# EAGLE design drives (EAGLE 6.6.0)
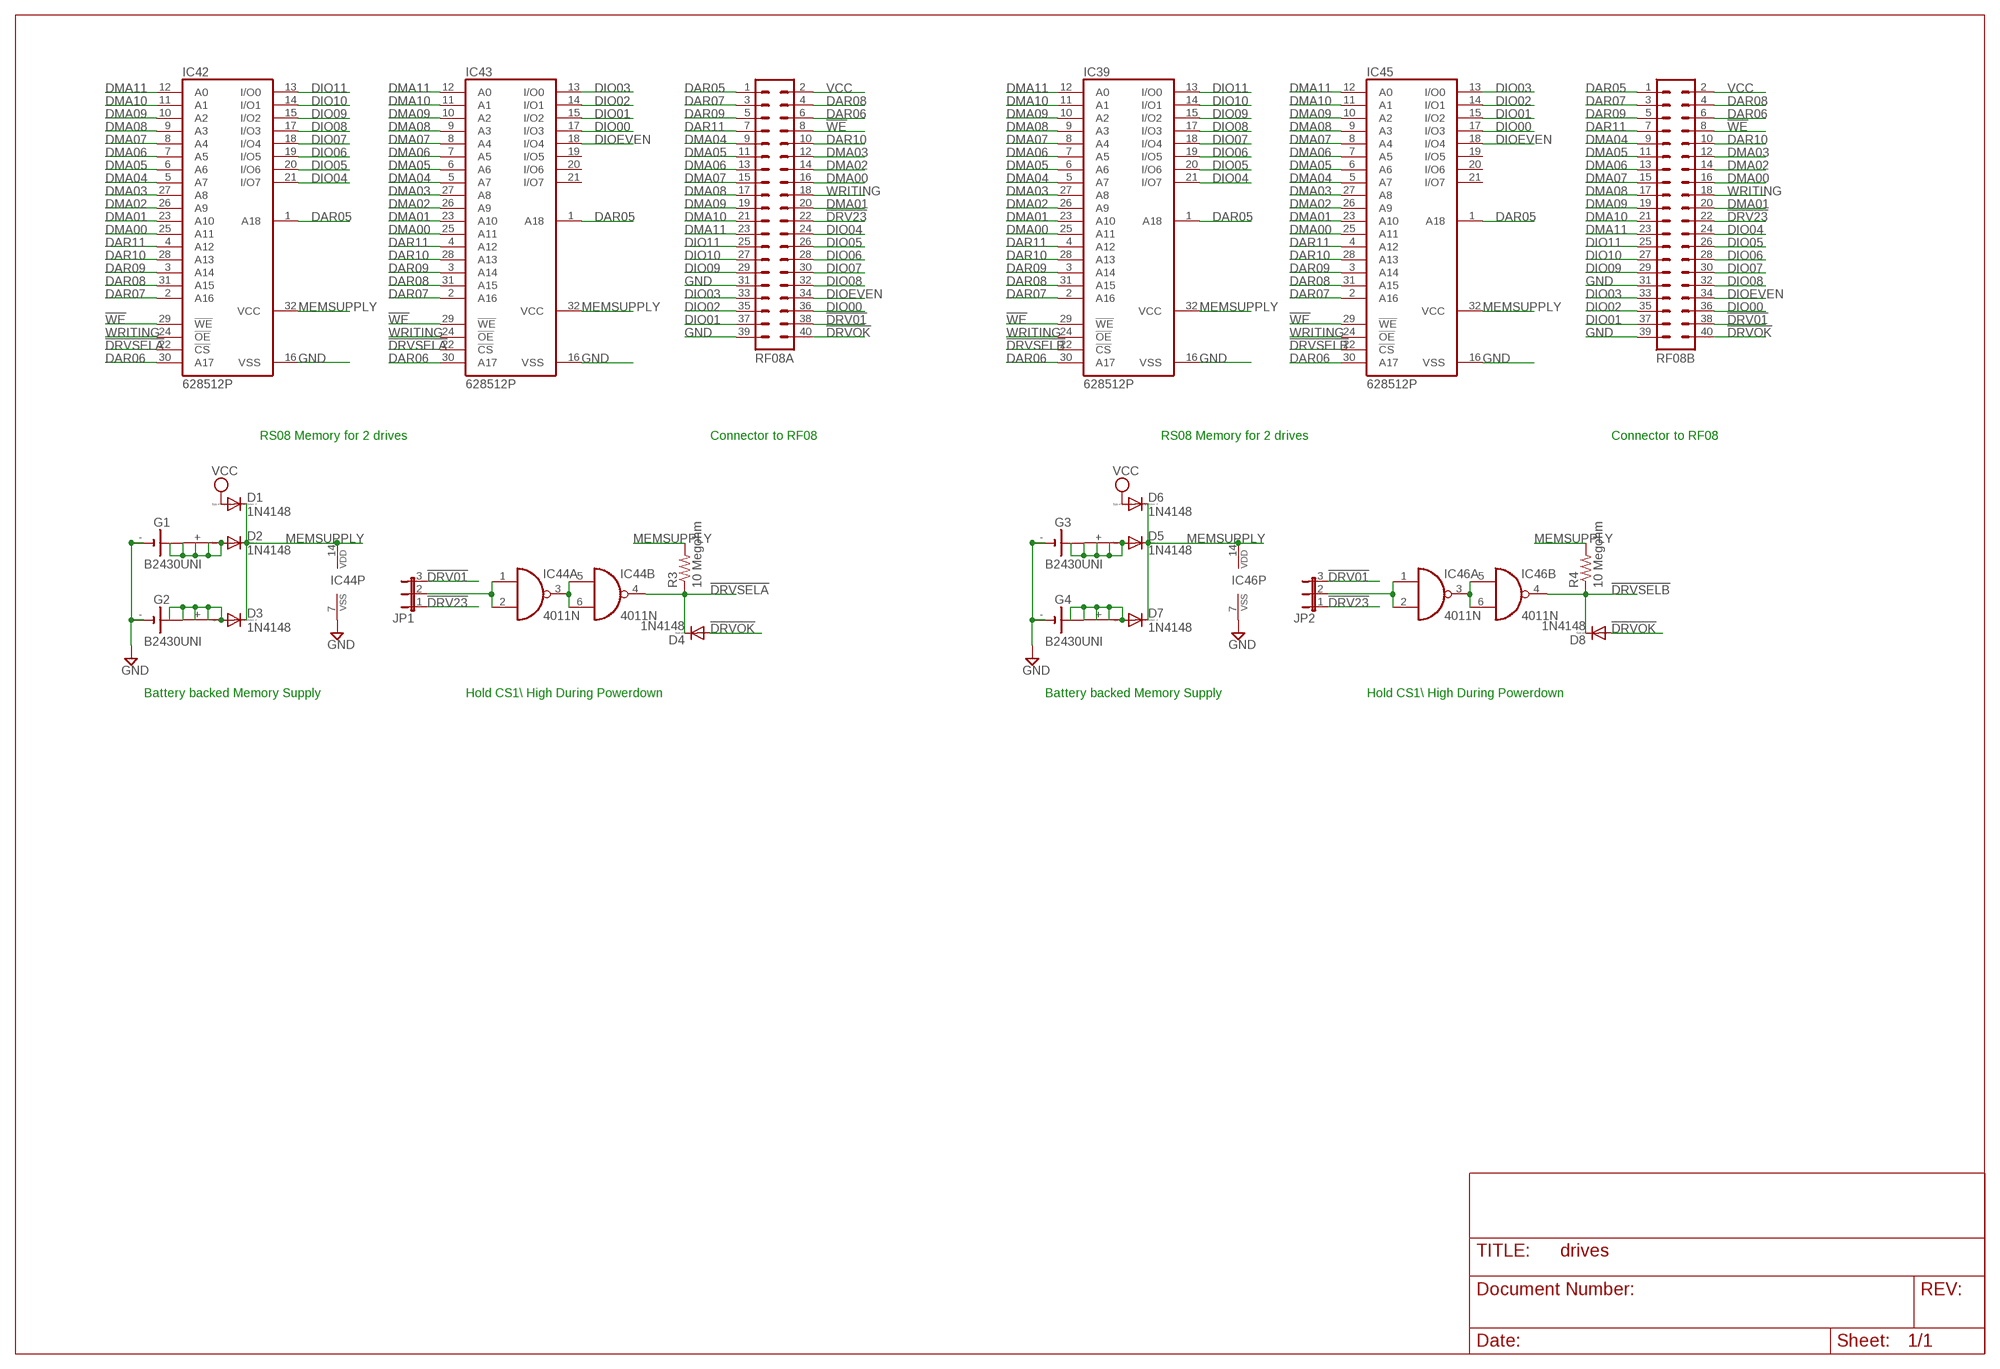
[diagram p0: schematic, sheet 1]

## Parts
D1  1N4148  1N4148DO35-10  [DO35-10]
D2  1N4148  1N4148DO35-10  [DO35-10]
D3  1N4148  1N4148DO35-10  [DO35-10]
D4  1N4148  1N4148DO35-10  [DO35-10]
D5  1N4148  1N4148DO35-10  [DO35-10]
D6  1N4148  1N4148DO35-10  [DO35-10]
D7  1N4148  1N4148DO35-10  [DO35-10]
D8  1N4148  1N4148DO35-10  [DO35-10]
G1  B2430UNI  [B2430UNI]
G2  B2430UNI  [B2430UNI]
G3  B2430UNI  [B2430UNI]
G4  B2430UNI  [B2430UNI]
IC39  628512P  [DIL32]
IC42  628512P  [DIL32]
IC43  628512P  [DIL32]
IC44  4011N  [DIL14]
IC45  628512P  [DIL32]
IC46  4011N  [DIL14]
JP1  JP2E  [JP2]
JP2  JP2E  [JP2]
R3  10 Megohm  R-US_0207/10  [0207/10]
R4  10 Megohm  R-US_0207/10  [0207/10]
RF08A  MA20-2  [MA20-2]
RF08B  MA20-2  [MA20-2]

## Nets
!DRV01: JP1.3 JP2.3 RF08A.38 RF08B.38
!DRV23: JP1.1 JP2.1 RF08A.22 RF08B.22
!DRVOK: D4.A D8.A RF08A.40 RF08B.40
!DRVSELA: D4.C IC42.22(!CS) IC43.22(!CS) IC44.4(B:O) R3.1
!DRVSELB: D8.C IC39.22(!CS) IC45.22(!CS) IC46.4(B:O) R4.1
!WE: IC39.29(!WE) IC42.29(!WE) IC43.29(!WE) IC45.29(!WE) RF08A.8 RF08B.8
DAR05: IC39.1(A18) IC42.1(A18) IC43.1(A18) IC45.1(A18) RF08A.1 RF08B.1
DAR06: IC39.30(A17) IC42.30(A17) IC43.30(A17) IC45.30(A17) RF08A.6 RF08B.6
DAR07: IC39.2(A16) IC42.2(A16) IC43.2(A16) IC45.2(A16) RF08A.3 RF08B.3
DAR08: IC39.31(A15) IC42.31(A15) IC43.31(A15) IC45.31(A15) RF08A.4 RF08B.4
DAR09: IC39.3(A14) IC42.3(A14) IC43.3(A14) IC45.3(A14) RF08A.5 RF08B.5
DAR10: IC39.28(A13) IC42.28(A13) IC43.28(A13) IC45.28(A13) RF08A.10 RF08B.10
DAR11: IC39.4(A12) IC42.4(A12) IC43.4(A12) IC45.4(A12) RF08A.7 RF08B.7
DIO00: IC43.17(I/O3) IC45.17(I/O3) RF08A.36 RF08B.36
DIO01: IC43.15(I/O2) IC45.15(I/O2) RF08A.37 RF08B.37
DIO02: IC43.14(I/O1) IC45.14(I/O1) RF08A.35 RF08B.35
DIO03: IC43.13(I/O0) IC45.13(I/O0) RF08A.33 RF08B.33
DIO04: IC39.21(I/O7) IC42.21(I/O7) RF08A.24 RF08B.24
DIO05: IC39.20(I/O6) IC42.20(I/O6) RF08A.26 RF08B.26
DIO06: IC39.19(I/O5) IC42.19(I/O5) RF08A.28 RF08B.28
DIO07: IC39.18(I/O4) IC42.18(I/O4) RF08A.30 RF08B.30
DIO08: IC39.17(I/O3) IC42.17(I/O3) RF08A.32 RF08B.32
DIO09: IC39.15(I/O2) IC42.15(I/O2) RF08A.29 RF08B.29
DIO10: IC39.14(I/O1) IC42.14(I/O1) RF08A.27 RF08B.27
DIO11: IC39.13(I/O0) IC42.13(I/O0) RF08A.25 RF08B.25
DIOEVEN: IC43.18(I/O4) IC45.18(I/O4) RF08A.34 RF08B.34
DMA00: IC39.25(A11) IC42.25(A11) IC43.25(A11) IC45.25(A11) RF08A.16 RF08B.16
DMA01: IC39.23(A10) IC42.23(A10) IC43.23(A10) IC45.23(A10) RF08A.20 RF08B.20
DMA02: IC39.26(A9) IC42.26(A9) IC43.26(A9) IC45.26(A9) RF08A.14 RF08B.14
DMA03: IC39.27(A8) IC42.27(A8) IC43.27(A8) IC45.27(A8) RF08A.12 RF08B.12
DMA04: IC39.5(A7) IC42.5(A7) IC43.5(A7) IC45.5(A7) RF08A.9 RF08B.9
DMA05: IC39.6(A6) IC42.6(A6) IC43.6(A6) IC45.6(A6) RF08A.11 RF08B.11
DMA06: IC39.7(A5) IC42.7(A5) IC43.7(A5) IC45.7(A5) RF08A.13 RF08B.13
DMA07: IC39.8(A4) IC42.8(A4) IC43.8(A4) IC45.8(A4) RF08A.15 RF08B.15
DMA08: IC39.9(A3) IC42.9(A3) IC43.9(A3) IC45.9(A3) RF08A.17 RF08B.17
DMA09: IC39.10(A2) IC42.10(A2) IC43.10(A2) IC45.10(A2) RF08A.19 RF08B.19
DMA10: IC39.11(A1) IC42.11(A1) IC43.11(A1) IC45.11(A1) RF08A.21 RF08B.21
DMA11: IC39.12(A0) IC42.12(A0) IC43.12(A0) IC45.12(A0) RF08A.23 RF08B.23
GND: G1.- G1.-@1(-) G2.- G2.-@1(-) G3.- G3.-@1(-) G4.- G4.-@1(-) IC39.16(VSS) IC42.16(VSS) IC43.16(VSS) IC44.7(P:VSS) IC45.16(VSS) IC46.7(P:VSS) RF08A.31 RF08A.39 RF08B.31 RF08B.39
MEMSUPPLY [Power]: D1.C D2.C D3.C D5.C D6.C D7.C IC39.32(VCC) IC42.32(VCC) IC43.32(VCC) IC44.14(P:VDD) IC45.32(VCC) IC46.14(P:VDD) R3.2 R4.2
N$18: IC44.3(A:O) IC44.5(B:I0) IC44.6(B:I1)
N$35: IC44.1(A:I0) IC44.2(A:I1) JP1.2
N$36: D7.A G4.+ G4.+@1(+) G4.+@2(+) G4.+@3(+) G4.+@4(+)
N$38: IC46.3(A:O) IC46.5(B:I0) IC46.6(B:I1)
N$39: IC46.1(A:I0) IC46.2(A:I1) JP2.2
N$41: D5.A G3.+ G3.+@1(+) G3.+@2(+) G3.+@3(+) G3.+@4(+)
N$130: D3.A G2.+ G2.+@1(+) G2.+@2(+) G2.+@3(+) G2.+@4(+)
N$131: D2.A G1.+ G1.+@1(+) G1.+@2(+) G1.+@3(+) G1.+@4(+)
VCC [Power]: D1.A D6.A RF08A.2 RF08B.2
WRITING: IC39.24(!OE) IC42.24(!OE) IC43.24(!OE) IC45.24(!OE) RF08A.18 RF08B.18
Unconnected: IC43.19(I/O5) IC43.20(I/O6) IC43.21(I/O7) IC44.8(C:I0) IC44.9(C:I1) IC44.10(C:O) IC44.11(D:O) IC44.12(D:I0) IC44.13(D:I1) IC45.19(I/O5) IC45.20(I/O6) IC45.21(I/O7) IC46.8(C:I0) IC46.9(C:I1) IC46.10(C:O) IC46.11(D:O) IC46.12(D:I0) IC46.13(D:I1)

## Notes on the sheet
- RS08 Memory for 2 drives | Connector to RF08 | RS08 Memory for 2 drives | Connector to RF08
- Battery backed Memory Supply | Hold CS1\\ High During Powerdown | Battery backed Memory Supply | Hold CS1\\ High During Powerdown

## Library data of the parts
D1-D8 = diode:1N4148: DIODE high speed (Philips)
G1-G4 = battery:B2430UNI: LI BATTERY
IC39 IC42 IC43 IC45 = dec-con:628512P: 512Kx8 Static RAM
IC44 IC46 = 40xx:4011: Quad 2-input NAND
JP1 JP2 = jumper:JP2E: JUMPER
R3 R4 = rcl:R-US_: RESISTOR, American symbol
RF08A RF08B = con-lstb:MA20-2: PIN HEADER; OC_FARNELL: unknown; OC_NEWARK: unknown

## Net classes
1 Power: width 0.508 mm

## Board
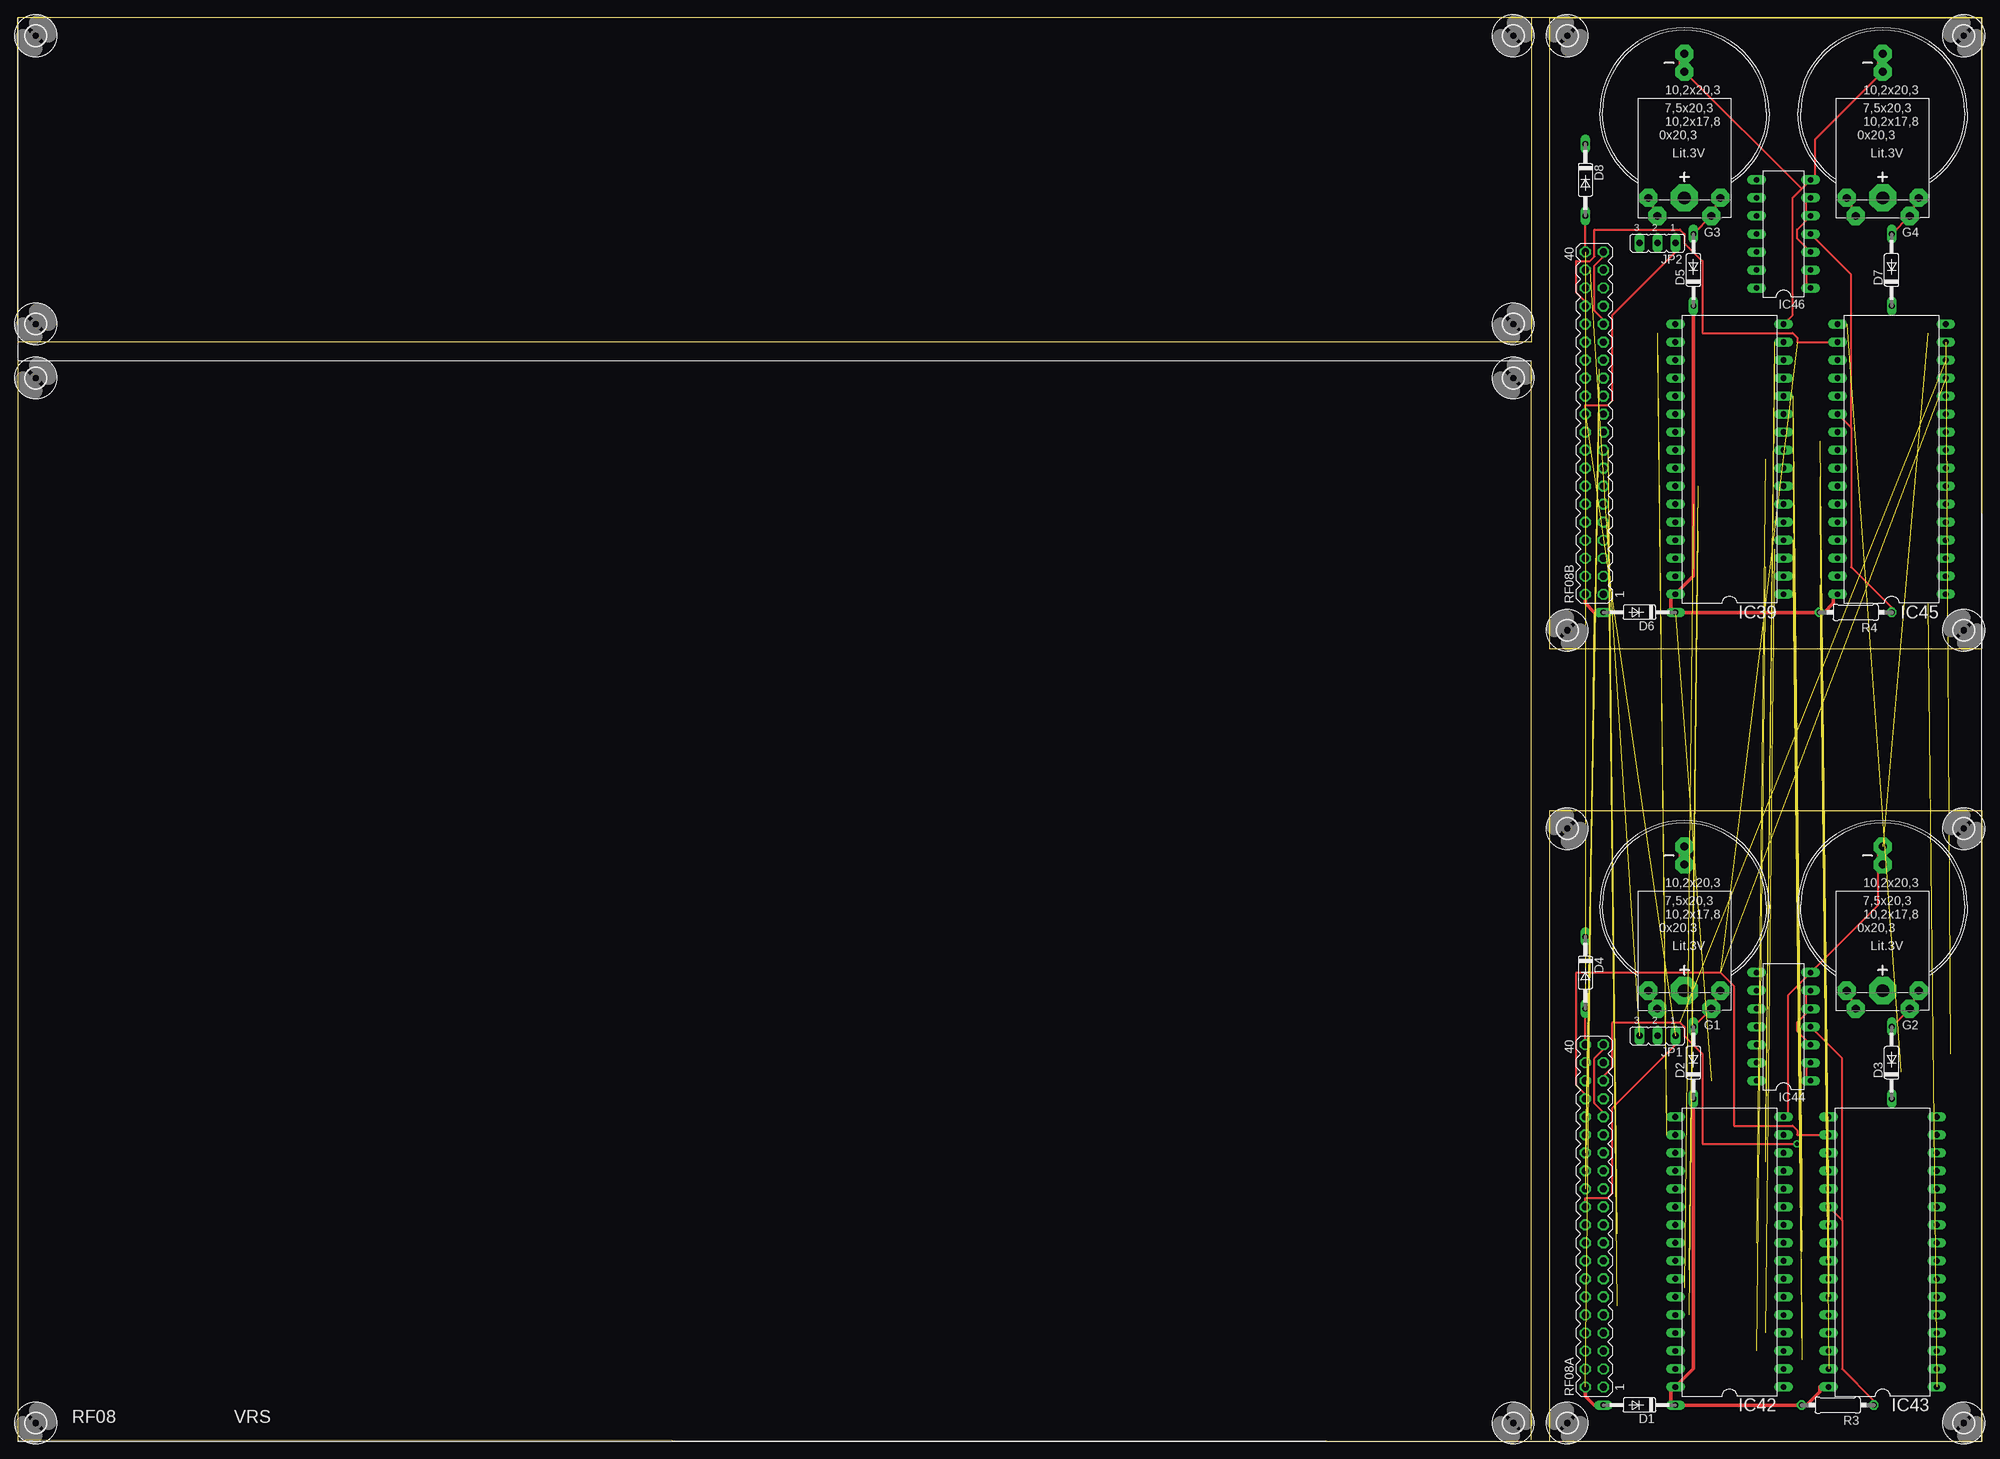
[diagram p1: board, top side]
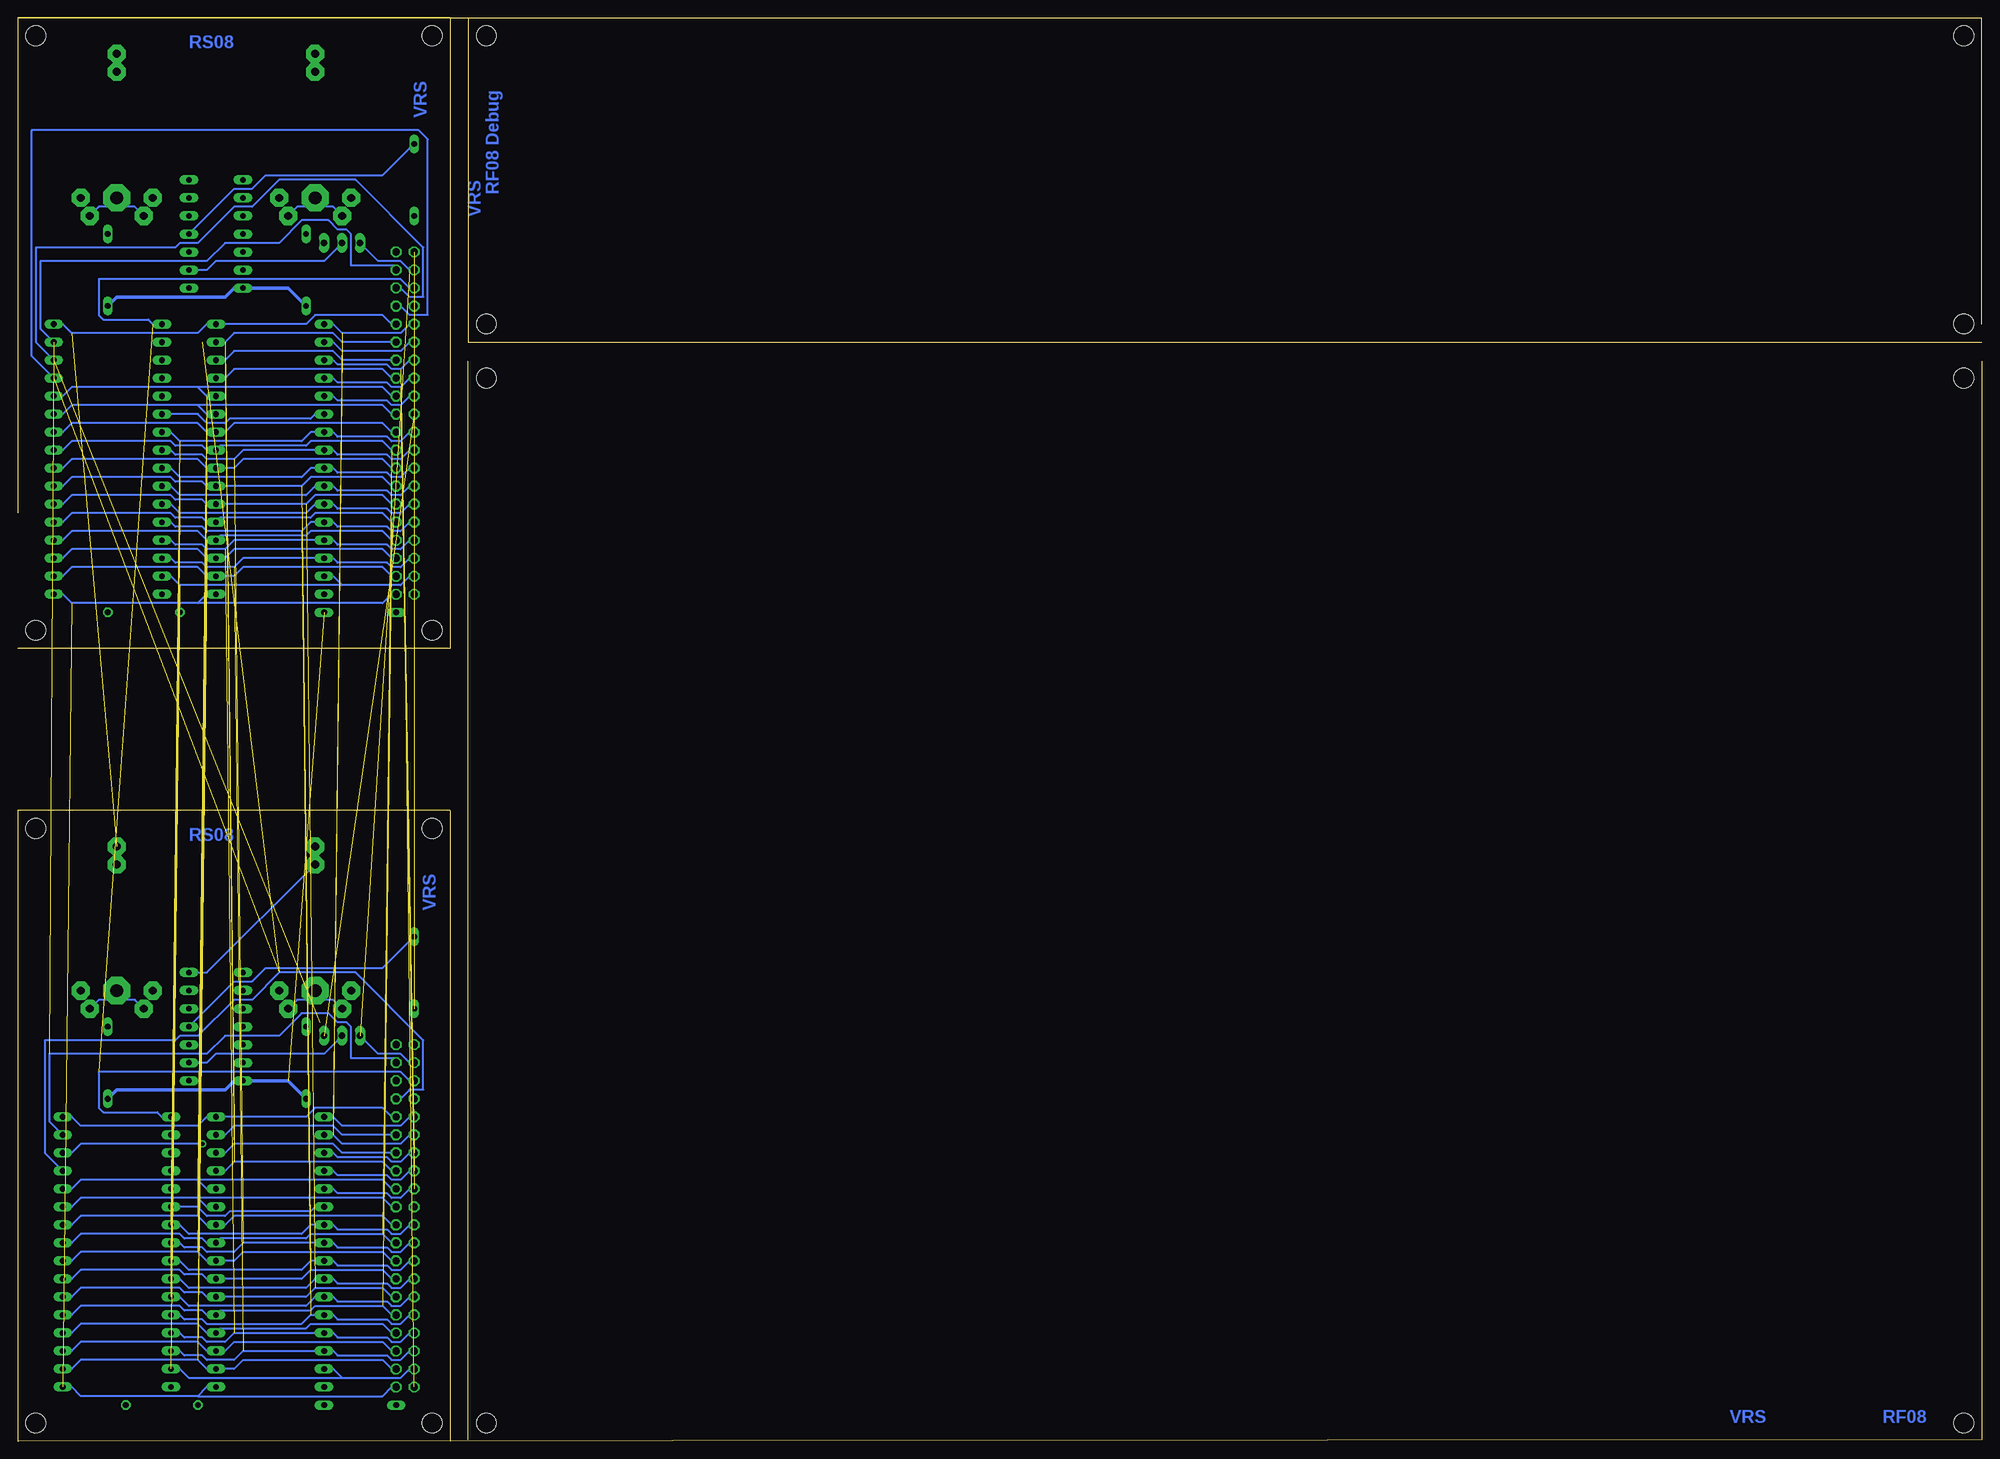
[diagram p2: board, bottom side, seen from below]

Size 276.86 x 200.67 mm. Coordinates in mm from the lower left corner, seen from the top.
Outline: 276.69,0 0.01,0.18 0.01,152.25
Outline: 213.34,0.18 213.34,152.25
Outline: 215.9,0.01 215.9,88.92 276.86,88.92 276.86,0.01
Outline: 276.86,111.78 215.9,111.78 215.9,200.67 276.86,200.67
Outline: 276.86,200.67 0,200.67 0,157.49
Outline: 276.86,200.67 276.86,130.82
Outline: 0,154.95 213.36,154.95 213.36,200.67
Copper layers (1*16): Top 0.035mm / dielectric 1.5mm / Bottom 0.035mm
Design rules "olimex10mil": minimum track width 10mil, minimum drill 24mil, track to track 10mil, track to pad 10mil, pad to pad 10mil, via to via 10mil, smd to smd 10mil, copper to edge 40mil, drill to drill 10mil, minimum pad ring 10mil, minimum via ring 8mil, stop-mask expansion 0mil, vias tented up to drill 0mil, thermal gap 10mil

### Footprints (pad centres in the part's own frame; a part is rotated, then mirrored left to right if it is on the bottom)
DO35-10 = drill 0.813 long: A 5.08,0; C -5.08,0
B2430UNI = drill 1.118 pad 2.54 octagon: + 3.81,14.605; +@1 -3.81,14.605; +@2 -5.08,12.065; +@3 5.08,12.065; - 0,-5.715; -@1 0,-8.255 | drill 1.803 pad 3.81 octagon: +@4 0,12.065
DIL32 = drill 0.813 long: 1 -19.05,-7.62; 2 -16.51,-7.62; 3 -13.97,-7.62; 4 -11.43,-7.62; 5 -8.89,-7.62; 6 -6.35,-7.62; 7 -3.81,-7.62; 8 -1.27,-7.62; 9 1.27,-7.62; 10 3.81,-7.62; 11 6.35,-7.62; 12 8.89,-7.62; 13 11.43,-7.62; 14 13.97,-7.62; 15 16.51,-7.62; 16 19.05,-7.62; 17 19.05,7.62; 18 16.51,7.62; 19 13.97,7.62; 20 11.43,7.62; 21 8.89,7.62; 22 6.35,7.62; 23 3.81,7.62; 24 1.27,7.62; 25 -1.27,7.62; 26 -3.81,7.62; 27 -6.35,7.62; 28 -8.89,7.62; 29 -11.43,7.62; 30 -13.97,7.62; 31 -16.51,7.62; 32 -19.05,7.62
DIL14 = drill 0.813 long: 1 -7.62,-3.81; 2 -5.08,-3.81; 3 -2.54,-3.81; 4 0,-3.81; 5 2.54,-3.81; 6 5.08,-3.81; 7 7.62,-3.81; 8 7.62,3.81; 9 5.08,3.81; 10 2.54,3.81; 11 0,3.81; 12 -2.54,3.81; 13 -5.08,3.81; 14 -7.62,3.81
JP2 = drill 0.914 long: 1 -2.54,0; 2 0,0; 3 2.54,0
0207/10 = drill 0.813 octagon: 1 -5.08,0; 2 5.08,0
MA20-2 = drill 1.016 octagon: 1 -24.13,-1.27; 2 -24.13,1.27; 3 -21.59,-1.27; 4 -21.59,1.27; 5 -19.05,-1.27; 6 -19.05,1.27; 7 -16.51,-1.27; 8 -16.51,1.27; 9 -13.97,-1.27; 10 -13.97,1.27; 11 -11.43,-1.27; 12 -11.43,1.27; 13 -8.89,-1.27; 14 -8.89,1.27; 15 -6.35,-1.27; 16 -6.35,1.27; 17 -3.81,-1.27; 18 -3.81,1.27; 19 -1.27,-1.27; 20 -1.27,1.27; 21 1.27,-1.27; 22 1.27,1.27; 23 3.81,-1.27; 24 3.81,1.27; 25 6.35,-1.27; 26 6.35,1.27; 27 8.89,-1.27; 28 8.89,1.27; 29 11.43,-1.27; 30 11.43,1.27; 31 13.97,-1.27; 32 13.97,1.27; 33 16.51,-1.27; 34 16.51,1.27; 35 19.05,-1.27; 36 19.05,1.27; 37 21.59,-1.27; 38 21.59,1.27; 39 24.13,-1.27; 40 24.13,1.27
2,8 = hole 2.8: 0,0

### Placement (x,y rotation side)
D1  228.6,5.09 180 top
D2  236.22,53.36 90 top
D3  264.16,53.36 90 top
D4  220.98,66.06 270 top
D5  236.22,165.11 90 top
D6  228.6,116.86 180 top
D7  264.16,165.11 90 top
D8  220.98,177.81 270 top
G1  234.95,75.58 180 top
G2  262.89,75.58 180 top
G3  234.95,187.34 180 top
G4  262.89,187.34 180 top
IC39  241.3,138.44 90 top
IC42  241.3,26.69 90 top
IC43  262.89,26.69 90 top
IC44  248.92,58.44 90 top
IC45  264.16,138.44 90 top
IC46  248.92,170.19 90 top
JP1  231.14,57.16 180 top
JP2  231.14,168.92 180 top
R3  256.54,5.09 180 top
R4  259.08,116.86 180 top
RF08A  222.25,31.77 90 top
RF08B  222.25,143.52 90 top
U$1  [2,8]  2.54,149.88 0 top
U$2  [2,8]  210.82,149.88 0 top
U$3  [2,8]  2.54,2.56 0 top
U$4  [2,8]  210.82,2.56 0 top
U$5  [2,8]  274.32,2.56 90 top
U$6  [2,8]  218.44,2.56 90 top
U$7  [2,8]  218.44,86.38 90 top
U$8  [2,8]  274.32,86.38 90 top
U$9  [2,8]  274.32,198.13 90 top
U$10  [2,8]  274.32,114.31 90 top
U$11  [2,8]  218.44,114.31 90 top
U$12  [2,8]  218.44,198.13 90 top
U$13  [2,8]  2.54,157.49 0 top
U$14  [2,8]  2.54,198.13 0 top
U$16  [2,8]  210.82,157.49 0 top
U$17  [2,8]  210.82,198.13 0 top
U$18  [SIERRA-PROTO]  0,0.01 0 top

### Tracks (layer width: path | path; a pad name or v marks a point on that pad's centre or on a via)
!DRV01  (1 unrouted)
  Bottom 0.254: JP1.3 226.06,54.62 222.88,54.62 221.62,53.36 RF08A.38 | JP2.3 226.06,166.38 222.88,166.38 221.62,165.11 RF08B.38
!DRV23  (1 unrouted)
  Top 0.254: JP1.1 233.68,55.9 224.79,47.01 224.79,34.94 224.16,34.3 220.98,34.3 RF08A.22 | JP2.1 233.68,167.65 224.79,158.76 224.79,146.7 224.16,146.06 220.98,146.06 RF08B.22
!DRVOK  (1 unrouted)
  Top 0.254: RF08A.40 D4.A | RF08B.40 D8.A
!DRVSELA
  Top 0.254: 257.18,31.13 257.18,10.18 261.62,5.73 R3.1 | IC43.22 257.18,31.13 | 257.18,31.13 257.18,53.99 IC44.4
  Bottom 0.254: IC42.22 234.95,33.04 235.59,32.4 247.01,32.4 247.65,31.77 250.19,31.77 251.46,33.04 IC43.22 | D4.C 225.43,66.69 241.94,66.69 243.84,64.78 246.38,64.78 IC44.4
!DRVSELB
  Top 0.254: 258.44,142.89 258.44,123.2 264.16,117.49 R4.1 | IC45.22 258.44,142.89 | 258.44,142.89 258.44,164.48 IC46.4
  Bottom 0.254: IC39.22 234.95,144.79 235.59,144.16 247.01,144.16 247.65,143.52 250.19,143.52 251.46,144.79 IC45.22 | D8.C 225.43,178.45 241.94,178.45 243.84,176.54 246.38,176.54 IC46.4
!WE  (1 unrouted)
  Bottom 0.254: RF08A.8 221.62,15.26 222.88,13.99 224.16,13.99 224.79,14.62 231.78,14.62 232.41,15.26 IC42.29 246.38,15.26 247.65,13.99 250.19,13.99 250.82,14.62 253.37,14.62 254,15.26 IC43.29 | RF08B.8 221.62,127.02 222.88,125.75 224.16,125.75 224.79,126.38 231.78,126.38 232.41,127.02 IC39.29 246.38,127.02 247.65,125.75 250.19,125.75 250.82,126.38 254.63,126.38 255.27,127.02 IC45.29
DAR05  (1 unrouted)
  Bottom 0.254: 251.46,118.12 250.19,119.39 IC39.1 | 251.46,118.12 269.24,118.12 270.51,119.39 IC45.1 | 251.46,118.12 225.43,118.12 224.16,119.39 RF08B.1 | 251.46,6.36 250.19,7.63 IC42.1 | 251.46,6.36 267.97,6.36 269.24,7.63 IC43.1 | 251.46,6.36 225.43,6.36 224.16,7.63 RF08A.1
DAR06  (1 unrouted)
  Bottom 0.254: RF08A.6 221.62,12.71 222.88,11.45 224.16,11.45 224.79,12.08 231.78,12.08 232.41,12.71 IC42.30 245.11,12.71 246.38,11.45 250.19,11.45 250.82,12.08 253.37,12.08 254,12.71 IC43.30 | RF08B.6 221.62,124.47 222.88,123.2 224.16,123.2 224.79,123.84 231.78,123.84 232.41,124.47 IC39.30 245.11,124.47 246.38,123.2 250.19,123.2 250.82,123.84 254.63,123.84 255.27,124.47 IC45.30
DAR07  (1 unrouted)
  Bottom 0.254: IC43.2 269.24,10.18 267.97,11.45 251.46,11.45 250.19,10.18 IC42.2 246.38,10.18 245.11,11.45 225.43,11.45 224.16,10.18 RF08A.3 | IC45.2 270.51,121.94 269.24,123.2 251.46,123.2 250.19,121.94 IC39.2 246.38,121.94 245.11,123.2 225.43,123.2 224.16,121.94 RF08B.3
DAR08  (1 unrouted)
  Bottom 0.254: 231.14,8.91 232.41,10.18 IC42.31 | 231.14,8.91 222.88,8.91 221.62,10.18 RF08A.4 | 231.14,8.91 252.73,8.91 254,10.18 IC43.31 | 231.14,120.67 232.41,121.94 IC39.31 | 231.14,120.67 222.88,120.67 221.62,121.94 RF08B.4 | 231.14,120.67 254,120.67 255.27,121.94 IC45.31
DAR09  (1 unrouted)
  Bottom 0.254: IC45.3 270.51,124.47 269.24,125.75 251.46,125.75 250.19,124.47 IC39.3 247.65,124.47 246.38,125.75 225.43,125.75 224.16,124.47 RF08B.5 | IC43.3 269.24,12.71 267.97,13.99 251.46,13.99 250.19,12.71 IC42.3 247.65,12.71 246.38,13.99 225.43,13.99 224.16,12.71 RF08A.5
DAR10  (1 unrouted)
  Bottom 0.254: RF08A.10 221.62,17.8 222.88,16.53 224.16,16.53 224.79,17.16 231.78,17.16 232.41,17.8 IC42.28 235.59,17.8 236.85,16.53 250.19,16.53 250.82,17.16 253.37,17.16 254,17.8 IC43.28 | RF08B.10 221.62,129.55 222.88,128.28 224.16,128.28 224.79,128.92 231.78,128.92 232.41,129.55 IC39.28 235.59,129.55 236.85,128.28 250.19,128.28 250.82,128.92 254.63,128.92 255.27,129.55 IC45.28
DAR11  (1 unrouted)
  Bottom 0.254: IC45.4 270.51,127.02 269.24,128.28 251.46,128.28 250.19,127.02 IC39.4 248.28,127.65 236.22,127.65 235.59,128.28 225.43,128.28 224.16,127.02 RF08B.7 | IC43.4 269.24,15.26 267.97,16.53 251.46,16.53 250.19,15.26 IC42.4 248.28,15.89 236.22,15.89 235.59,16.53 225.43,16.53 224.16,15.26 RF08A.7
DIO00  (1 unrouted)
  Bottom 0.254: IC43.17 256.54,45.73 257.18,46.37 264.8,46.37 265.43,47.01 265.43,52.09 222.88,52.09 221.62,50.81 RF08A.36 | IC45.17 257.81,157.49 258.44,158.13 264.8,158.13 265.43,158.76 265.43,163.84 222.88,163.84 221.62,162.57 RF08B.36
DIO01  (1 unrouted)
  Bottom 0.254: IC43.15 272.42,45.1 272.42,54.62 250.19,54.62 247.65,57.16 240.03,57.16 236.85,60.34 233.04,60.34 231.78,59.07 230.5,59.07 229.87,58.44 229.87,53.99 223.52,53.99 RF08A.37 | IC45.15 273.69,156.86 273.69,166.38 250.19,166.38 247.65,168.92 240.03,168.92 236.85,172.1 233.04,172.1 231.78,170.83 230.5,170.83 229.87,170.19 229.87,165.75 223.52,165.75 RF08B.37
DIO02  (via drill 0.61)  (1 unrouted)
  Top 0.254: v250.82,41.92 237.49,41.92 237.49,54.62 234.95,57.16 234.95,58.44 234.31,59.07 224.79,59.07 224.79,52.72 223.52,51.45 RF08A.35
  Bottom 0.254: v250.82,41.92 267.97,41.92 269.24,40.66 IC43.14 | IC45.14 274.32,154.95 274.32,168.29 254.63,168.29 254,168.92 251.46,168.92 246.38,174 243.84,174 240.03,177.81 229.24,177.81 219.71,168.29 219.71,161.3 221.62,161.3 222.88,162.57 RF08B.35
DIO03  (1 unrouted)
  Bottom 0.254: IC43.13 273.05,40.66 273.05,56.53 254.63,56.53 254,57.16 251.46,57.16 246.38,62.24 243.84,62.24 240.03,66.06 229.24,66.06 219.71,56.53 219.71,49.55 221.62,49.55 222.88,48.27 RF08A.33 | IC45.13 274.95,153.05 274.95,184.8 220.34,184.8 219.07,183.53 219.07,158.76 221.62,158.76 222.88,160.03 RF08B.33
DIO04  (1 unrouted)
  Bottom 0.254: IC42.21 232.41,35.58 231.78,34.94 224.79,34.94 224.16,34.3 222.88,34.3 221.62,35.58 RF08A.24 | IC39.21 232.41,147.33 231.78,146.7 224.79,146.7 224.16,146.06 222.88,146.06 221.62,147.33 RF08B.24
DIO05  (1 unrouted)
  Bottom 0.254: IC42.20 232.41,38.12 231.78,37.48 224.79,37.48 224.16,36.84 222.88,36.84 221.62,38.12 RF08A.26 | IC39.20 232.41,149.88 231.78,149.24 224.79,149.24 224.16,148.6 222.88,148.6 221.62,149.88 RF08B.26
DIO06  (1 unrouted)
  Bottom 0.254: IC42.19 232.41,40.66 231.78,40.02 224.79,40.02 224.16,39.38 222.88,39.38 221.62,40.66 RF08A.28 | IC39.19 232.41,152.41 231.78,151.78 224.79,151.78 224.16,151.14 222.88,151.14 221.62,152.41 RF08B.28
DIO07  (1 unrouted)
  Bottom 0.254: IC42.18 232.41,43.2 231.14,41.92 222.88,41.92 221.62,43.2 RF08A.30 | IC39.18 232.41,154.95 231.14,153.68 222.88,153.68 221.62,154.95 RF08B.30
DIO08  (1 unrouted)
  Bottom 0.254: IC42.17 232.41,45.73 231.14,44.47 222.88,44.47 221.62,45.73 RF08A.32 | IC39.17 232.41,157.49 231.14,156.22 222.88,156.22 221.62,157.49 RF08B.32
DIO09  (1 unrouted)
  Bottom 0.254: IC42.15 247.65,43.2 246.38,44.47 232.41,44.47 231.14,43.2 RF08A.29 | IC39.15 247.65,154.95 246.38,156.22 232.41,156.22 231.14,154.95 RF08B.29
DIO10  (1 unrouted)
  Bottom 0.254: IC42.14 247.65,40.66 246.38,41.92 232.41,41.92 231.14,40.66 RF08A.27 | IC39.14 247.65,152.41 246.38,153.68 232.41,153.68 231.14,152.41 RF08B.27
DIO11  (1 unrouted)
  Bottom 0.254: IC42.13 247.65,38.12 246.38,39.38 225.43,39.38 224.16,38.12 RF08A.25 | IC39.13 247.65,149.88 246.38,151.14 225.43,151.14 224.16,149.88 RF08B.25
DIOEVEN  (1 unrouted)
  Top 0.254: IC43.18 250.82,43.2 250.82,43.83 250.19,44.47 241.94,44.47 241.94,64.15 240.03,66.06 219.71,66.06 219.71,50.18 220.98,48.91 RF08A.34 | IC45.18 250.82,154.95 250.82,155.59 250.19,156.22 237.49,156.22 237.49,166.38 234.95,168.92 234.95,170.19 234.31,170.83 222.25,170.83 222.25,167.02 221.62,166.38 219.71,166.38 219.71,161.94 220.98,160.67 RF08B.34
DMA00  (1 unrouted)
  Bottom 0.254: RF08A.16 221.62,25.41 222.88,24.14 224.16,24.14 224.79,24.78 231.78,24.78 232.41,25.41 IC42.25 235.59,25.41 236.85,24.14 252.73,24.14 254,25.41 IC43.25 | RF08B.16 221.62,137.17 222.88,135.9 224.16,135.9 224.79,136.54 231.78,136.54 232.41,137.17 IC39.25 235.59,137.17 236.85,135.9 254,135.9 255.27,137.17 IC45.25
DMA01  (1 unrouted)
  Bottom 0.254: RF08A.20 221.62,30.5 222.88,29.23 224.16,29.23 224.79,29.86 231.78,29.86 232.41,30.5 IC42.23 235.59,30.5 236.85,29.23 252.73,29.23 254,30.5 IC43.23 | RF08B.20 221.62,142.25 222.88,140.98 224.16,140.98 224.79,141.62 231.78,141.62 232.41,142.25 IC39.23 235.59,142.25 236.85,140.98 254,140.98 255.27,142.25 IC45.23
DMA02  (1 unrouted)
  Bottom 0.254: RF08A.14 221.62,22.88 222.88,21.61 224.16,21.61 224.79,22.24 231.78,22.24 232.41,22.88 IC42.26 234.95,22.88 236.22,21.61 252.73,21.61 254,22.88 IC43.26 | RF08B.14 221.62,134.63 222.88,133.36 224.16,133.36 224.79,134 231.78,134 232.41,134.63 IC39.26 234.95,134.63 236.22,133.36 254,133.36 255.27,134.63 IC45.26
DMA03  (1 unrouted)
  Bottom 0.254: RF08A.12 221.62,20.34 222.88,19.07 224.16,19.07 224.79,19.7 231.78,19.7 232.41,20.34 IC42.27 234.95,20.34 236.22,19.07 252.73,19.07 254,20.34 IC43.27 | RF08B.12 221.62,132.09 222.88,130.82 224.16,130.82 224.79,131.46 231.78,131.46 232.41,132.09 IC39.27 234.95,132.09 236.22,130.82 254,130.82 255.27,132.09 IC45.27
DMA04  (1 unrouted)
  Bottom 0.254: IC43.5 269.24,17.8 267.97,19.07 254,19.07 253.37,18.43 250.82,18.43 250.19,17.8 IC42.5 248.28,18.43 235.59,18.43 234.95,19.07 225.43,19.07 224.16,17.8 RF08A.9 | IC45.5 270.51,129.55 269.24,130.82 255.27,130.82 254.63,130.19 250.82,130.19 250.19,129.55 IC39.5 248.28,130.19 235.59,130.19 234.95,130.82 225.43,130.82 224.16,129.55 RF08B.9
DMA05  (1 unrouted)
  Bottom 0.254: IC45.6 270.51,132.09 269.24,133.36 255.27,133.36 254.63,132.73 250.82,132.73 250.19,132.09 IC39.6 236.22,132.09 234.95,133.36 225.43,133.36 224.16,132.09 RF08B.11 | IC43.6 269.24,20.34 267.97,21.61 254,21.61 253.37,20.97 250.82,20.97 250.19,20.34 IC42.6 236.22,20.34 234.95,21.61 225.43,21.61 224.16,20.34 RF08A.11
DMA06  (1 unrouted)
  Bottom 0.254: IC45.7 270.51,134.63 269.24,135.9 255.27,135.9 254.63,135.27 250.82,135.27 250.19,134.63 IC39.7 236.85,134.63 235.59,135.9 225.43,135.9 224.16,134.63 RF08B.13 | IC43.7 269.24,22.88 267.97,24.14 254,24.14 253.37,23.51 250.82,23.51 250.19,22.88 IC42.7 236.85,22.88 235.59,24.14 225.43,24.14 224.16,22.88 RF08A.13
DMA07  (1 unrouted)
  Bottom 0.254: IC45.8 270.51,137.17 269.24,138.44 251.46,138.44 250.19,137.17 IC39.8 246.38,137.17 245.11,138.44 225.43,138.44 224.16,137.17 RF08B.15 | IC43.8 269.24,25.41 267.97,26.69 251.46,26.69 250.19,25.41 IC42.8 246.38,25.41 245.11,26.69 225.43,26.69 224.16,25.41 RF08A.15
DMA08  (1 unrouted)
  Bottom 0.254: IC45.9 270.51,139.71 269.24,140.98 255.27,140.98 254.63,140.35 250.82,140.35 250.19,139.71 IC39.9 248.28,140.35 236.22,140.35 235.59,140.98 225.43,140.98 224.16,139.71 RF08B.17 | IC43.9 269.24,27.96 267.97,29.23 254,29.23 253.37,28.59 250.82,28.59 250.19,27.96 IC42.9 248.28,28.59 236.22,28.59 235.59,29.23 225.43,29.23 224.16,27.96 RF08A.17
DMA09  (1 unrouted)
  Bottom 0.254: IC45.10 270.51,142.25 269.24,143.52 251.46,143.52 250.19,142.25 IC39.10 247.65,142.25 246.38,143.52 225.43,143.52 224.16,142.25 RF08B.19 | IC43.10 269.24,30.5 267.97,31.77 251.46,31.77 250.19,30.5 IC42.10 247.65,30.5 246.38,31.77 225.43,31.77 224.16,30.5 RF08A.19
DMA10  (1 unrouted)
  Bottom 0.254: 251.46,146.06 250.19,144.79 IC39.11 | 251.46,146.06 269.24,146.06 270.51,144.79 IC45.11 | 251.46,146.06 225.43,146.06 224.16,144.79 RF08B.21 | 251.46,34.3 250.19,33.04 IC42.11 | 251.46,34.3 267.97,34.3 269.24,33.04 IC43.11 | 251.46,34.3 225.43,34.3 224.16,33.04 RF08A.21
DMA11  (1 unrouted)
  Bottom 0.254: 251.46,148.6 250.19,147.33 IC39.12 | 251.46,148.6 269.24,148.6 270.51,147.33 IC45.12 | 251.46,148.6 225.43,148.6 224.16,147.33 RF08B.23 | 251.46,36.84 250.19,35.58 IC42.12 | 251.46,36.84 267.97,36.84 269.24,35.58 IC43.12 | 251.46,36.84 225.43,36.84 224.16,35.58 RF08A.23
GND  (1 unrouted)
  Top 0.254: G1.- 234.31,81.93 234.31,83.2 G1.-@1 | G2.-@1 262.25,83.2 262.25,81.93 G2.- 262.25,80.66 262.25,75.58 IC44.7 249.56,62.88 249.56,46.37 IC42.16 | RF08A.31 223.52,46.37 222.25,47.64 222.25,53.99 223.52,55.26 RF08A.39 | RF08B.31 223.52,158.13 222.25,159.4 222.25,165.75 223.52,167.02 RF08B.39 | G4.-@1 262.25,194.96 262.25,193.69 G4.- 253.37,183.53 253.37,178.45 IC46.7 251.46,176.54 | G3.-@1 234.31,194.96 234.31,193.69 G3.- 251.46,176.54 | 251.46,176.54 250.19,175.27 250.19,158.76 IC39.16
  Bottom 0.254: G1.- 250.19,66.06 IC44.7 | IC43.16 269.24,45.73 267.97,44.47 251.46,44.47 250.19,45.73 IC42.16 236.22,45.73 234.95,47.01 225.43,47.01 224.16,45.73 RF08A.31 | IC45.16 270.51,157.49 269.24,156.22 251.46,156.22 250.19,157.49 IC39.16 236.22,157.49 234.95,158.76 225.43,158.76 224.16,157.49 RF08B.31
MEMSUPPLY  (1 unrouted)
  Top 0.508: IC45.32 255.91,118.76 255.91,118.12 254.63,116.86 R4.2 D6.C 233.04,117.49 233.04,118.76 IC39.32 236.22,121.94 D5.C | IC43.32 254,7.63 254,7 252.09,5.09 R3.2 D1.C 233.04,5.73 233.04,7 IC42.32 236.22,10.18 D2.C
  Bottom 0.508: D5.C 238.76,162.57 IC46.14 246.38,162.57 247.65,161.3 262.89,161.3 D7.C | D2.C 238.76,50.81 IC44.14 246.38,50.81 247.65,49.55 262.89,49.55 D3.C
N$18
  Top 0.254: IC44.3 250.82,57.8 250.82,59.07 IC44.5 252.09,61.61 252.09,62.88 IC44.6
N$35
  Top 0.254: IC44.1 252.09,51.45 252.09,52.72 IC44.2
  Bottom 0.254: JP1.2 233.68,54.62 248.92,54.62 250.19,53.36 IC44.2
N$36
  Top 0.254: D7.A G4.+@1 267.33,173.37 267.33,174.64 G4.+@2 | G4.+ 258.44,173.37 258.44,174.64 G4.+@3
  Bottom 0.254: G4.+ 260.35,174 261.62,174 G4.+@4 264.16,174 265.43,174 G4.+@1
N$38
  Top 0.254: IC46.3 250.82,169.56 250.82,170.83 IC46.5 252.09,173.37 252.09,174.64 IC46.6
N$39
  Top 0.254: IC46.1 252.09,163.21 252.09,164.48 IC46.2
  Bottom 0.254: JP2.2 233.68,166.38 248.92,166.38 250.19,165.11 IC46.2
N$41
  Top 0.254: D5.A G3.+@1 239.4,173.37 239.4,174.64 G3.+@2 | G3.+ 230.5,173.37 230.5,174.64 G3.+@3
  Bottom 0.254: G3.+ 232.41,174 233.68,174 G3.+@4 236.22,174 237.49,174 G3.+@1
N$130
  Top 0.254: D3.A G2.+@1 267.33,61.61 267.33,62.88 G2.+@2 | G2.+ 258.44,61.61 258.44,62.88 G2.+@3
  Bottom 0.254: G2.+ 260.35,62.24 261.62,62.24 G2.+@4 264.16,62.24 265.43,62.24 G2.+@1
N$131
  Top 0.254: D2.A G1.+@1 239.4,61.61 239.4,62.88 G1.+@2 | G1.+ 230.5,61.61 230.5,62.88 G1.+@3
  Bottom 0.254: G1.+ 232.41,62.24 233.68,62.24 G1.+@4 236.22,62.24 237.49,62.24 G1.+@1
VCC  (1 unrouted)
  Top 0.508: D6.A 222.25,116.86 220.98,118.12 RF08B.2 | D1.A 222.25,5.09 220.98,6.36 RF08A.2
WRITING  (1 unrouted)
  Bottom 0.254: RF08A.18 221.62,27.96 222.88,26.69 224.16,26.69 224.79,27.32 231.78,27.32 232.41,27.96 IC42.24 245.11,27.96 246.38,26.69 250.19,26.69 250.82,27.32 253.37,27.32 254,27.96 IC43.24 | RF08B.18 221.62,139.71 222.88,138.44 224.16,138.44 224.79,139.08 231.78,139.08 232.41,139.71 IC39.24 245.11,139.71 246.38,138.44 250.19,138.44 250.82,139.08 254.63,139.08 255.27,139.71 IC45.24

### Text on the board
Bottom: RS08 | VRS | RF08 Debug | VRS | RS08 | VRS | RF08 | VRS
tPlace: RF08 | VRS
tValues: RF08 Debug | VRS | RS08 | VRS | RS08 | VRS